# EAGLE design hub (EAGLE 6.4)
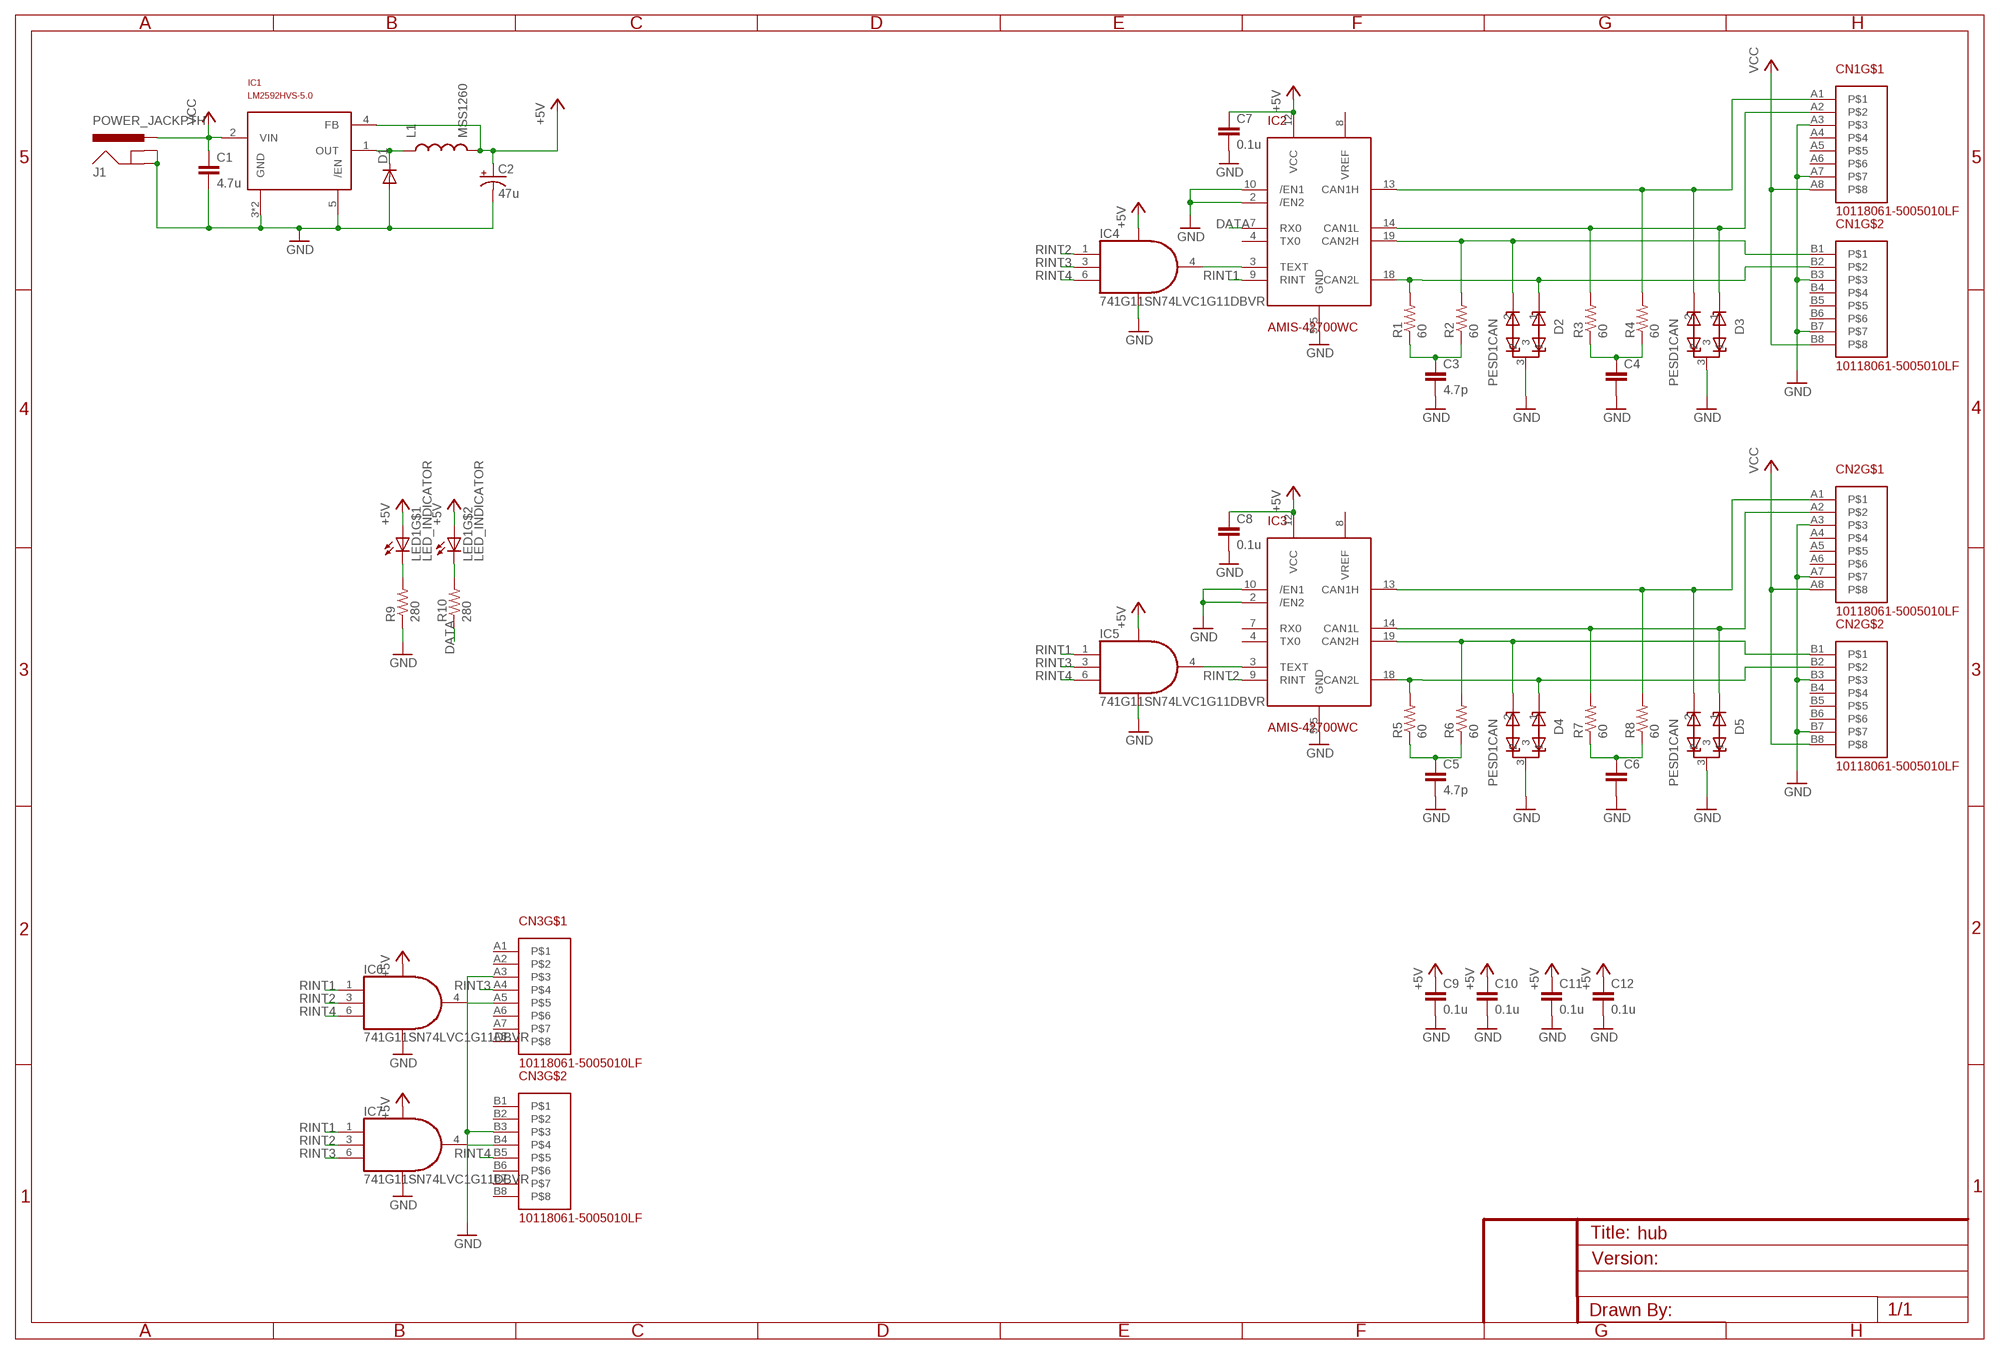
[diagram p0: schematic, sheet 1]

## Parts
C1  4.7u  CAP1206  [1206]
C2  47u  CAP_POLC  [PANASONIC_C]
C3  4.7p  CAP0603-CAP  [0603-CAP]
C4  CAP0603-CAP  [0603-CAP]
C5  4.7p  CAP0603-CAP  [0603-CAP]
C6  CAP0603-CAP  [0603-CAP]
C7  0.1u  CAP0603-CAP  [0603-CAP]
C8  0.1u  CAP0603-CAP  [0603-CAP]
C9  0.1u  CAP0603-CAP  [0603-CAP]
C10  0.1u  CAP0603-CAP  [0603-CAP]
C11  0.1u  CAP0603-CAP  [0603-CAP]
C12  0.1u  CAP0603-CAP  [0603-CAP]
CN1  10118061-5005010LF  [10118061]
CN2  10118061-5005010LF  [10118061]
CN3  10118061-5005010LF  [10118061]
D1  DIODESMA-ALT  [SMA-DIODE_ALT]
D2  PESD1CAN  [SOT23]
D3  PESD1CAN  [SOT23]
D4  PESD1CAN  [SOT23]
D5  PESD1CAN  [SOT23]
IC1  LM2592HVS-5.0  LM2595NDH  [TO263-5]
IC2  AMIS-42700WC  [SO20W]
IC3  AMIS-42700WC  [SO20W]
IC4  741G11SN74LVC1G11DBVR  [SOT23-6]
IC5  741G11SN74LVC1G11DBVR  [SOT23-6]
IC6  741G11SN74LVC1G11DBVR  [SOT23-6]
IC7  741G11SN74LVC1G11DBVR  [SOT23-6]
J1  POWER_JACKPTH  [POWER_JACK_PTH]
L1  MSS1260  [MSS1260]
LED1  LED_INDICATOR  [LED_INDICATOR]
R1  60  RESISTOR0603-RES  [0603-RES]
R2  60  RESISTOR0603-RES  [0603-RES]
R3  60  RESISTOR0603-RES  [0603-RES]
R4  60  RESISTOR0603-RES  [0603-RES]
R5  60  RESISTOR0603-RES  [0603-RES]
R6  60  RESISTOR0603-RES  [0603-RES]
R7  60  RESISTOR0603-RES  [0603-RES]
R8  60  RESISTOR0603-RES  [0603-RES]
R9  280  RESISTOR0603-RES  [0603-RES]
R10  280  RESISTOR0603-RES  [0603-RES]

## Nets
+5V: C2.+ C7.1 C8.1 C9.1 C10.1 C11.1 C12.1 IC1.4(FB) IC2.12(VCC) IC3.12(VCC) IC4.5(VCC) IC5.5(VCC) IC6.5(VCC) IC7.5(VCC) L1.P$2 LED1.A1(A) LED1.A2(A)
CAN1H: CN1.A1 D3.2 IC2.13(CAN1H) R4.2
CAN1L: CN1.A2 D3.1 IC2.14(CAN1L) R3.2
CAN2H: CN1.B1 D2.2 IC2.19(CAN2H) R2.2
CAN2L: CN1.B2 D2.1 IC2.18(CAN2L) R1.2
CAN3H: CN2.A1 D5.2 IC3.13(CAN1H) R8.2
CAN3L: CN2.A2 D5.1 IC3.14(CAN1L) R7.2
CAN4H: CN2.B1 D4.2 IC3.19(CAN2H) R6.2
CAN4L: CN2.B2 D4.1 IC3.18(CAN2L) R5.2
DATA: IC2.7(RX0) R10.1
GND: C1.2 C2.- C3.2 C4.2 C5.2 C6.2 C7.2 C8.2 C9.2 C10.2 C11.2 C12.2 CN1.A3 CN1.A7 CN1.B3 CN1.B7 CN2.A3 CN2.A7 CN2.B3 CN2.B7 CN3.A3 CN3.B3 D1.A D2.3 D3.3 D4.3 D5.3 IC1.3(GND) IC1.5(/EN) IC1.6(GND) IC2.2(/EN2) IC2.5(GND) IC2.6(GND) IC2.10(/EN1) IC2.15(GND) IC2.16(GND) IC2.17(GND) IC3.2(/EN2) IC3.5(GND) IC3.6(GND) IC3.10(/EN1) IC3.15(GND) IC3.16(GND) IC3.17(GND) IC4.2(GND) IC5.2(GND) IC6.2(GND) IC7.2(GND) J1.GND J1.GNDBREAK R9.1
N$1: IC2.3(TEXT) IC4.4(O)
N$2: C3.1 R1.1 R2.1
N$3: C4.1 R3.1 R4.1
N$4: IC3.3(TEXT) IC5.4(O)
N$5: C5.1 R5.1 R6.1
N$7: C6.1 R7.1 R8.1
N$8: CN3.A5 IC6.4(O)
N$9: CN3.B4 IC7.4(O)
N$10: LED1.C1(C) R9.2
N$11: LED1.C2(C) R10.2
RINT1: IC2.9(RINT) IC5.1(I0) IC6.1(I0) IC7.1(I0)
RINT2: IC3.9(RINT) IC4.1(I0) IC6.3(I1) IC7.3(I1)
RINT3: CN3.A4 IC4.3(I1) IC5.3(I1) IC7.6(I2)
RINT4: CN3.B5 IC4.6(I2) IC5.6(I2) IC6.6(I2)
SWOUT: D1.C IC1.1(OUT) L1.P$1
VCC: C1.1 CN1.A8 CN1.B8 CN2.A8 CN2.B8 IC1.2(VIN) J1.PWR
Unconnected: CN1.A4 CN1.A5 CN1.A6 CN1.B4 CN1.B5 CN1.B6 CN2.A4 CN2.A5 CN2.A6 CN2.B4 CN2.B5 CN2.B6 CN3.A1 CN3.A2 CN3.A6 CN3.A7 CN3.A8 CN3.B1 CN3.B2 CN3.B6 CN3.B7 CN3.B8 IC2.4(TX0) IC2.8(VREF) IC3.4(TX0) IC3.7(RX0) IC3.8(VREF)

## Library data of the parts
C1 C7-C12 = SparkFun-Capacitors:CAP: Capacitor Standard 0603 ceramic capacitor, and 0.1" leaded capacitor.
C2 = SparkFun-Capacitors:CAP_POL: Capacitor Polarized These are standard SMD and PTH capacitors. Normally 10uF, 47uF, and 100uF in electrolytic and tantalum varieties. Always verify the external diameter of the through hole cap, it varies with capacity, voltage, and manufacturer. The EIA devices should be standard.
C3-C6 = SparkFun-Passives:CAP: Capacitor Standard 0603 ceramic capacitor, and 0.1" leaded capacitor.
CN1-CN3 = nickparts:10118061
D1 = SparkFun-DiscreteSemi:DIODE: Diode These are standard reverse protection diodes and small signal diodes. SMA package can handle up to about 1A. SOD-323 can handle about 200mA. What the SOD-323 package when ordering, there are some mfgs out there that are 5-pin packages.
D2-D5 = nickparts:PESD1CAN
IC1 = nickparts:LM2595
IC2 IC3 = nickparts:AMIS-42700
IC4-IC7 = nickparts:74*1G11
J1 = SparkFun-Connectors:POWER_JACK: Power Jack This is the standard 5.5mm barrel jack for power. The PTH is the most common, proven, reliable, footprint. The Slot footprint only works if the mill layer is transmitted to the PCB fab house so be warned. Spark Fun Electronics SKU : PRT-00119 SMT: CONN-08106 Mating wall wart : TOL-00298 (and others)
L1 = nickparts:MSS1260
LED1 = nickparts:LED_INDICATOR
R1-R10 = SparkFun-Passives:RESISTOR: Resistor Basic schematic elements and footprints for 0603, 1206, and PTH resistors.

## Board
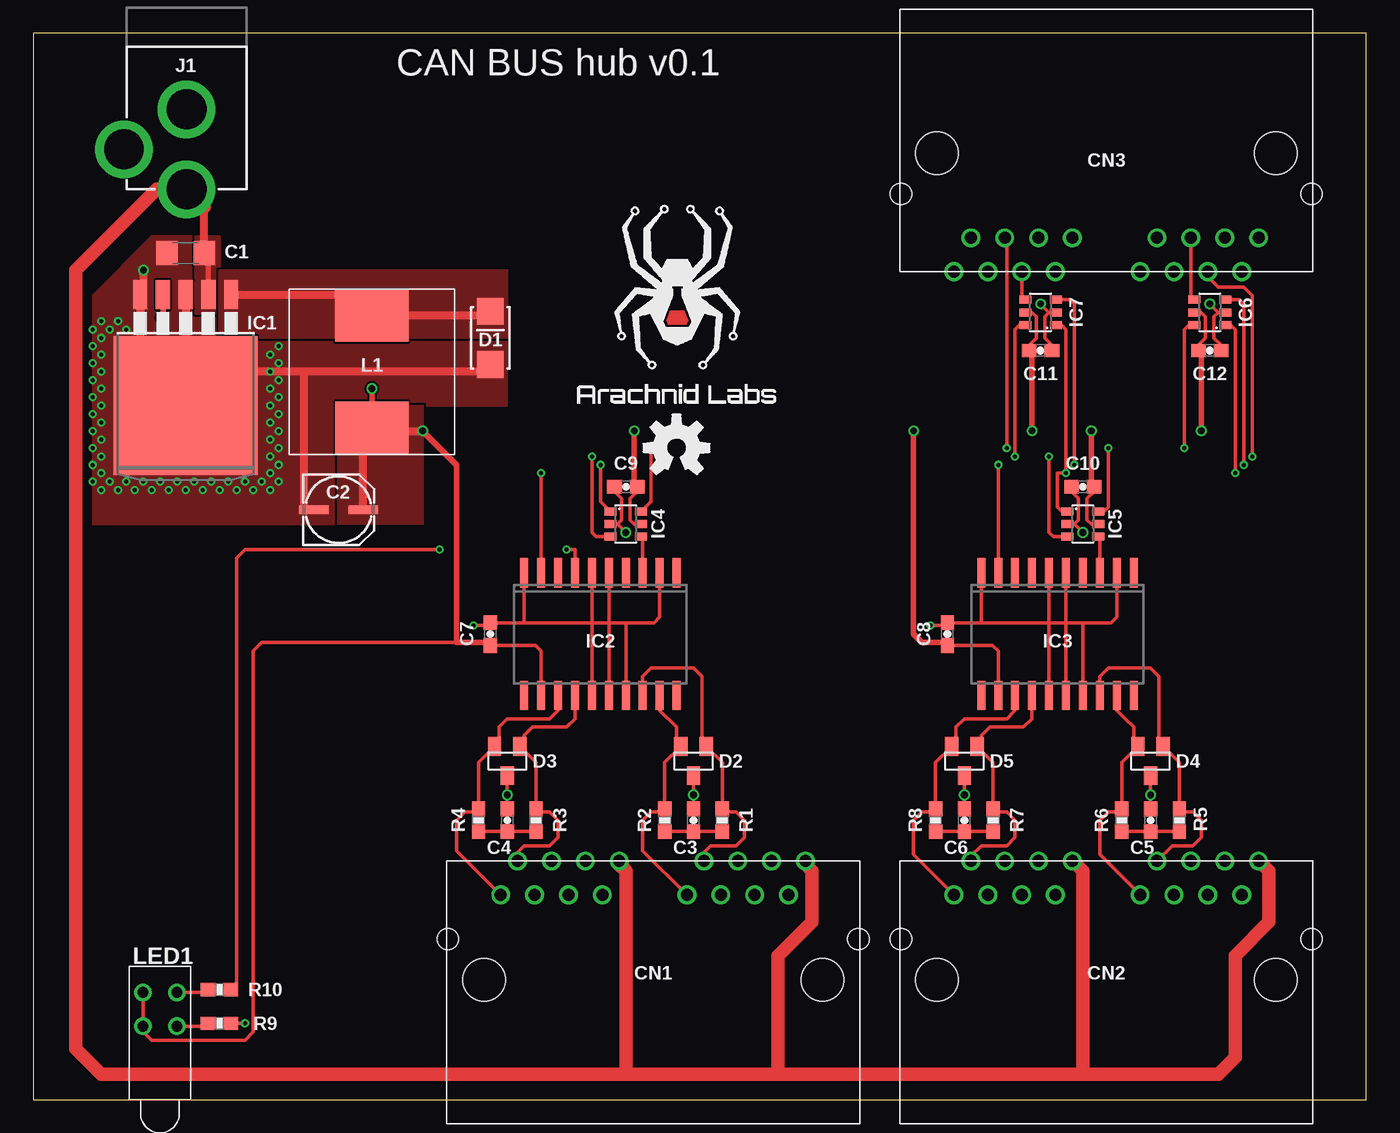
[diagram p1: board, top side]
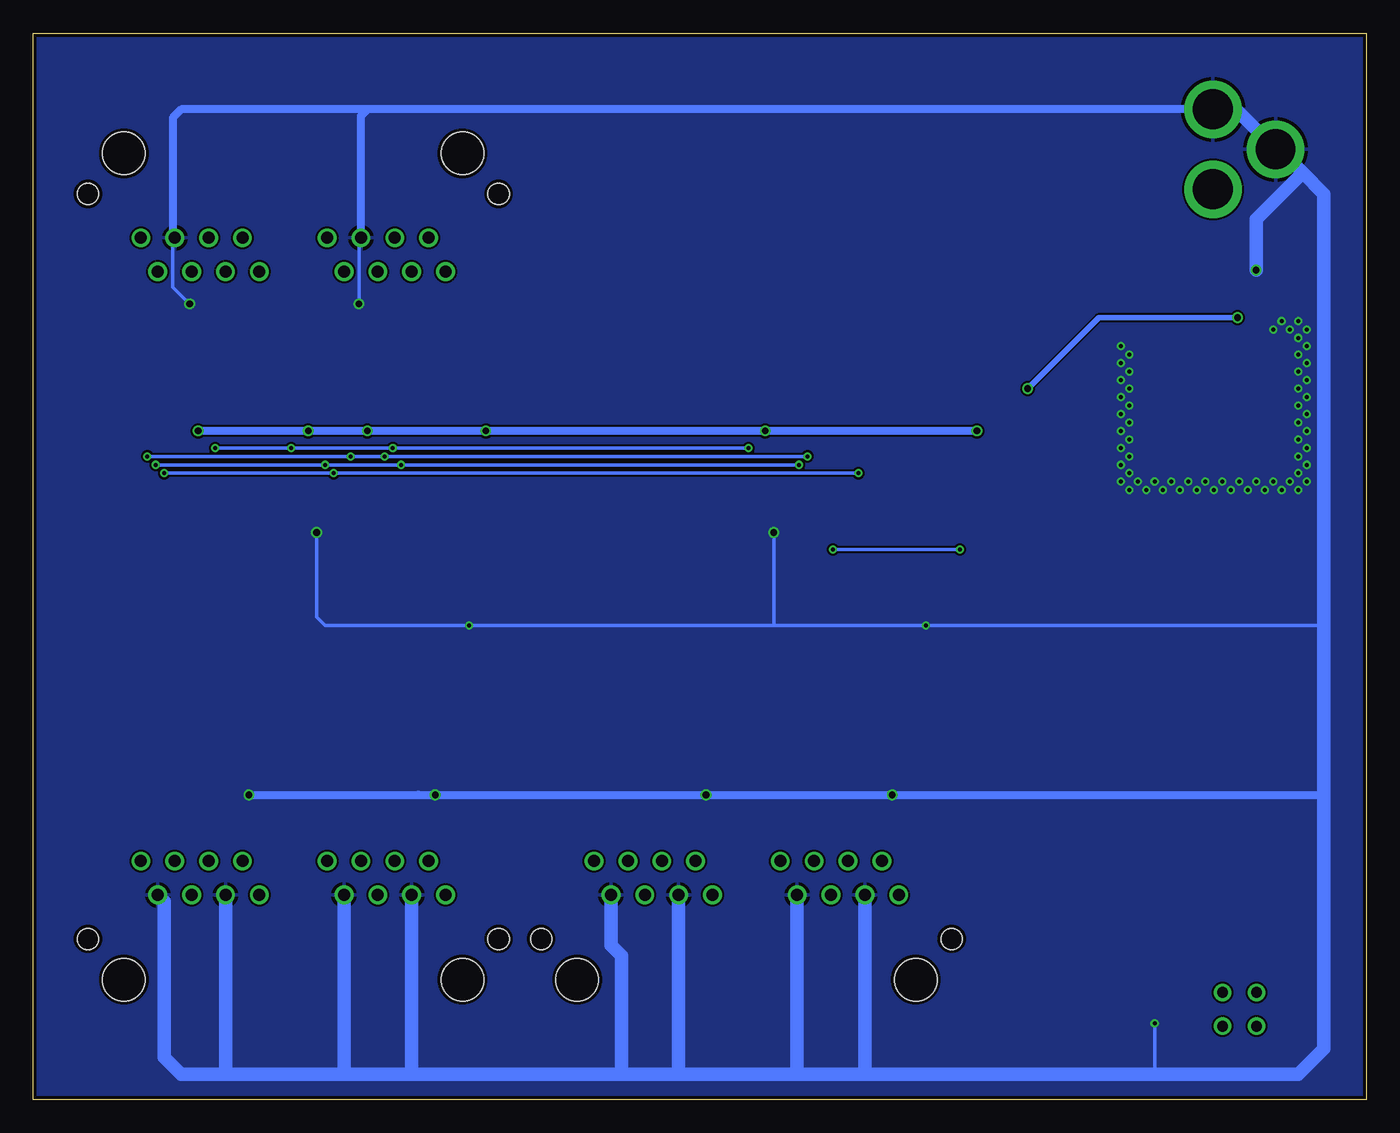
[diagram p2: board, bottom side, seen from below]

Size 100 x 80 mm. Coordinates in mm from the lower left corner, seen from the top.
Outline: 0,0 100,0 100,80 0,80 0,0
Copper layers (1*16): Top 0.035mm / dielectric 1.5mm / Bottom 0.035mm
Design rules "Fusion_eagle_rule_v1.1 *": minimum track width 6mil, minimum drill 0.3mm, track to track 6mil, track to pad 6mil, pad to pad 6mil, via to via 6mil, smd to smd 0mil, copper to edge 10mil, drill to drill 10mil, minimum pad ring 10mil, minimum via ring 6mil, stop-mask expansion 2mil, vias tented up to drill 100mil, thermal gap 10mil
tKeepout: area 0,0 to 2,80; area 98,0 to 100,80

### Footprints (pad centres in the part's own frame; a part is rotated, then mirrored left to right if it is on the bottom)
1206 = smd 1.6 x 1.8: 1 -1.4,0; 2 1.4,0
PANASONIC_C = smd 2.2 x 0.65: + 1.9,-0.2; - -1.8,-0.2
0603-CAP = smd 1.1 x 1: 1 -0.85,0; 2 0.85,0
10118061 = drill 0.9: A1 -11.43,6.35; A2 -10.16,8.89; A3 -8.89,6.35; A4 -7.62,8.89; A5 -6.35,6.35; A6 -5.08,8.89; A7 -3.81,6.35; A8 -2.54,8.89; B1 2.54,6.35; B2 3.81,8.89; B3 5.08,6.35; B4 6.35,8.89; B5 7.62,6.35; B6 8.89,8.89; B7 10.16,6.35; B8 11.43,8.89 | hole 3.2: -12.7,0; 12.7,0 | hole 1.6: -15.4,3.05; 15.4,3.05
SMA-DIODE_ALT = smd 2 x 2: A -2,0; C 2,0
SOT23 = smd 1 x 1.4: 1 -0.95,-1.1; 2 0.95,-1.1; 3 0,1.1
TO263-5 = smd 1.067 x 2.159: 1 -3.404,-5.791; 2 -1.702,-5.791; 3 0,-5.791; 4 1.702,-5.791; 5 3.404,-5.791 | smd 10.8 x 10.41: 6 0,2.54
SO20W = smd 0.6 x 2.2: 1 -5.715,-4.6; 2 -4.445,-4.6; 3 -3.175,-4.6; 4 -1.905,-4.6; 5 -0.635,-4.6; 6 0.635,-4.6; 7 1.905,-4.6; 8 3.175,-4.6; 9 4.445,-4.6; 10 5.715,-4.6; 11 5.715,4.6; 12 4.445,4.6; 13 3.175,4.6; 14 1.905,4.6; 15 0.635,4.6; 16 -0.635,4.6; 17 -1.905,4.6; 18 -3.175,4.6; 19 -4.445,4.6; 20 -5.715,4.6
SOT23-6 = smd 0.6 x 0.9: 1 -0.95,-1.15; 2 0,-1.15; 3 0.95,-1.15; 4 0.95,1.15; 5 0,1.15; 6 -0.95,1.15
POWER_JACK_PTH = drill 2.997 pad 4.318: GND 0,7.7; GNDBREAK 4.7,10.7; PWR 0,13.7
MSS1260 = smd 5.5 x 4: P$1 0,4.25; P$2 0,-4.25
LED_INDICATOR = drill 0.8: A1 1.27,0; A2 1.27,-2.54; C1 -1.27,0; C2 -1.27,-2.54
0603-RES = smd 1.1 x 1: 1 -0.85,0; 2 0.85,0

### Placement (x,y rotation side)
C1  11.43,63.5 180 top
C2  22.86,44.45 0 top
C3  49.53,20.95 90 top
C4  35.56,20.95 90 top
C5  83.82,20.95 90 top
C6  69.85,20.95 90 top
C7  34.29,34.92 90 top
C8  68.58,34.92 90 top
C9  44.45,45.97 180 top
C10  78.74,45.97 180 top
C11  75.56,56.2 0 top
C12  88.27,56.2 0 top
CN1  46.5,9 0 top
CN2  80.5,9 0 top
CN3  80.5,71 180 top
D1  34.29,57.15 90 top
D2  49.53,25.4 180 top
D3  35.56,25.4 180 top
D4  83.82,25.4 180 top
D5  69.85,25.4 180 top
IC1  11.43,54.61 180 top
IC2  42.55,34.92 180 top
IC3  76.83,34.92 180 top
IC4  44.45,43.18 270 top
IC5  78.74,43.18 270 top
IC6  88.27,59.05 90 top
IC7  75.56,59.05 90 top
J1  11.5,82 180 top
L1  25.4,54.61 0 top
LED1  9.5,5.5 180 top
R1  51.69,20.95 90 top
R2  47.37,20.95 90 top
R3  37.72,20.95 90 top
R4  33.4,20.95 90 top
R5  85.98,20.95 90 top
R6  81.66,20.95 90 top
R7  72.01,20.95 90 top
R8  67.69,20.95 90 top
R9  13.97,5.71 180 top
R10  13.97,8.26 180 top
U$1  [ARACHNID_LABS_LOGO]  48.26,62.23 0 top
U$2  [OSHW-LOGO-M]  48.26,48.9 0 top

### Tracks (layer width: path | path; a pad name or v marks a point on that pad's centre or on a via)
+5V  (via drill 0.5)
  Top 0.254: C9.1 45.3,45.62 44.77,45.09 44.77,43.5 45.09,43.18 IC4.5 | C10.1 79.59,45.62 79.06,45.09 79.06,43.5 79.38,43.18 IC5.5 | IC3.12 72.39,33.66 71.97,34.08 C8.1 | C7.1 37.68,34.08 38.1,33.66 IC2.12 | LED1.A1 LED1.A2 8.23,5.74 8.26,5.71 8.26,5.08 8.89,4.45 15.88,4.45 16.51,5.08 16.51,33.66 17.14,34.29 31.75,34.29 | C11.1 74.72,56.62 75.25,57.15 75.25,58.74 74.93,59.05 IC7.5 | C12.1 87.42,56.62 87.95,57.15 87.95,58.74 87.63,59.05 IC6.5
  Top 0.406: IC1.4 9.73,58.75 v9.65,58.67 | v25.4,53.34 L1.P$2 | v87.63,50.16 87.63,55.98 C12.1 | C11.1 74.72,56.09 74.93,55.88 v74.93,50.16 | C10.1 79.59,46.14 79.38,46.35 v79.38,50.16 | 45.3,45.62 45.3,46.14 45.09,46.35 v45.09,50.16 | C8.1 68.58,34.29 66.67,34.29 66.04,34.92 v66.04,50.16 | C7.1 34.29,34.29 31.75,34.29 31.75,34.92 31.75,47.62 v29.21,50.16
  Top 0.61: L1.P$2 24.76,49.72 C2.+ 24.76,50.16 24.77,50.16 v29.21,50.16
  Bottom 0.406: v9.65,58.67 20.07,58.67 v25.4,53.34 | v74.93,50.16 74.3,50.16 | v79.38,50.16 78.74,50.16 | v45.09,50.16 44.45,50.16 | v66.04,50.16 64.77,50.16
  Bottom 0.61: v29.21,50.16 44.45,50.16 v45.09,50.16 64.77,50.16 v66.04,50.16 74.3,50.16 v74.93,50.16 78.74,50.16 v79.38,50.16 v87.63,50.16
  pour Top (no thermals): 29.21,43.18 22.86,43.18 22.86,52.07 29.21,52.07
CAN1H
  Top 0.254: CN1.A1 31.75,18.67 31.75,20.95 32.38,21.59 33.02,21.59 33.23,21.8 R4.2 33.4,25.29 D3.2 34.92,26.82 34.92,27.94 35.56,28.57 38.73,28.57 39.37,29.21 IC2.13
CAN1L
  Top 0.254: CN1.A2 36.34,18.56 36.83,19.05 38.73,19.05 39.37,19.68 39.37,20.95 38.73,21.59 37.93,21.59 R3.2 37.72,25.29 36.9,26.11 | 36.9,26.11 D3.1 | IC2.14 40.64,28.57 40.01,27.94 37.47,27.94 36.83,27.3 36.83,26.18 36.9,26.11
CAN2H
  Top 0.254: CN1.B1 45.72,18.67 45.72,20.95 46.35,21.59 46.99,21.59 47.2,21.8 R2.2 47.37,25.29 D2.2 48.26,26.82 48.26,27.94 46.99,29.21 IC2.19
CAN2L
  Top 0.254: CN1.B2 50.31,18.56 50.8,19.05 52.7,19.05 53.34,19.68 53.34,20.95 52.7,21.59 51.9,21.59 R1.2 51.69,25.29 D2.1 50.34,26.5 50.16,26.67 50.16,31.75 49.53,32.38 46.35,32.38 45.72,31.75 IC2.18
CAN3H
  Top 0.254: CN2.A1 66.04,18.38 66.04,20.95 66.67,21.59 67.31,21.59 67.53,21.8 R8.2 67.69,25.29 D5.2 69.22,26.82 69.22,27.94 69.85,28.57 73.03,28.57 73.66,29.21 IC3.13
CAN3L
  Top 0.254: CN2.A2 70.34,18.27 71.12,19.05 73.03,19.05 73.66,19.68 73.66,20.95 73.03,21.59 72.22,21.59 R7.2 72.01,25.29 D5.1 71.12,26.82 71.12,27.3 71.75,27.94 74.3,27.94 74.93,28.57 IC3.14
CAN4H
  Top 0.254: CN2.B1 80.01,18.38 80.01,20.95 80.64,21.59 81.92,21.59 81.7,21.8 R6.2 81.66,25.29 D4.2 82.55,26.82 82.55,27.94 81.92,28.57 81.28,29.21 IC3.19
CAN4L
  Top 0.254: CN2.B2 85.47,19.05 87,19.05 87.63,19.68 87.63,20.95 87,21.59 86.36,21.59 86.14,21.8 R5.2 85.98,25.29 D4.1 84.62,26.5 84.45,26.67 84.45,31.75 83.82,32.38 80.64,32.38 80.01,31.75 IC3.18
DATA  (via drill 0.3)
  Top 0.254: R10.1 15.24,8.26 15.24,40.64 15.88,41.27 v30.48,41.27 | v40.01,41.27 40.64,41.27 IC2.7
  Bottom 0.254: v30.48,41.27 v40.01,41.27
GND  (via drill 0.3, 0.5)
  Top 0.254: D5.3 C6.2 69.85,22.23 v69.85,22.86 | v83.82,22.86 C5.2 v83.82,22.86 | v83.82,22.86 D4.3 | D2.3 C3.2 49.53,22.23 v49.53,22.86 | C4.2 v35.56,22.86 | v35.56,22.86 D3.3 | C9.2 43.6,45.62 44.13,45.09 44.13,43.5 43.81,43.18 | 43.81,43.18 IC4.2 43.81,43.18 | C10.2 77.89,45.62 78.42,45.09 78.42,43.5 78.11,43.18 | 78.11,43.18 IC5.2 78.11,43.18 | R9.1 v15.88,5.71 | 71.12,35.77 76.2,35.77 | 76.2,35.77 77.47,35.77 | 77.47,35.77 78.74,35.77 | 78.74,35.77 80.86,35.77 81.28,36.2 IC3.2 | IC3.5 77.47,35.77 | IC3.6 76.2,35.77 | IC3.10 71.12,35.77 | IC3.15 76.2,35.77 | IC3.16 77.47,35.77 | IC3.17 78.74,35.77 | 36.83,35.77 41.91,35.77 | 41.91,35.77 43.18,35.77 | 43.18,35.77 44.45,35.77 | 44.45,35.77 46.57,35.77 46.99,36.2 IC2.2 | IC2.17 44.45,35.77 | IC2.16 43.18,35.77 | IC2.15 41.91,35.77 | IC2.5 43.18,35.77 | IC2.6 41.91,35.77 | IC2.10 36.83,35.77 | v33.02,35.56 34.29,35.56 C7.2 36.83,35.77 | v67.31,35.56 68.58,35.56 C8.2 71.12,35.77 | 76.2,59.05 75.88,58.74 75.88,57.15 76.42,56.62 C11.2 76.42,56.09 76.2,55.88 | 76.2,59.05 IC7.2 | C12.2 89.11,56.62 88.58,57.15 88.58,58.74 88.9,59.05 | 88.9,59.05 IC6.2 88.9,59.05 | C4.2 v35.56,22.86 | 43.81,43.18 v44.45,42.55 | 78.11,43.18 v78.74,42.55 | 76.2,59.05 v75.56,59.69 | 88.9,59.05 v88.27,59.69 | C4.2 35.56,22.23 v35.56,22.86
  Top 0.61: IC1.3 11.43,59.69 11.43,54.61 | 11.43,54.61 IC1.6 8.03,55.47 8.03,59.69 IC1.5 8.26,60.63 v8.26,62.23 | D1.A 34.29,54.61 20.32,54.61 | 20.32,54.61 v17.78,54.61 11.43,54.61 | C2.- 20.52,44.25 20.32,44.45 20.32,54.61
  Bottom 0.254: v15.88,5.71 15.88,1.91 | 3.17,35.56 v33.02,35.56 44.45,35.56 | 44.45,35.56 v67.31,35.56 78.11,35.56 78.74,36.2 v78.74,42.55 | v44.45,42.55 44.45,35.56 | v75.56,59.69 75.56,64.5 CN3.B3 | v88.27,59.69 89.53,60.96 89.53,64.5 CN3.A3 | v69.85,22.86 71.12,22.86
  Bottom 0.61: 74.93,74.3 J1.GND 9.8,74.3 | 74.93,74.3 88.89,74.3 89.53,73.66 89.53,64.8 CN3.A3 | CN3.B3 75.42,73.81 74.93,74.3 | v83.82,22.86 71.12,22.86 v69.85,22.86 v49.53,22.86 v35.56,22.86 3.17,22.86
  Bottom 1.016: 9.8,74.3 J1.GNDBREAK 6.53,71.3 4.76,69.53 | 4.76,69.53 3.17,67.94 3.17,35.56 3.17,22.86 3.17,3.81 5.08,1.91 15.88,1.91 37.47,1.91 | 37.47,1.91 42.55,1.91 | 42.55,1.91 51.44,1.91 | 51.44,1.91 55.88,1.91 | 55.88,1.91 71.75,1.91 | 71.75,1.91 76.83,1.91 | 76.83,1.91 85.72,1.91 | 85.72,1.91 88.9,1.91 90.17,3.17 90.17,14.86 CN2.B7 | CN2.B3 85.58,2.05 85.72,1.91 | CN2.A7 76.69,2.05 76.83,1.91 | CN2.A3 71.61,2.05 71.75,1.91 | CN1.B7 56.66,11.57 55.88,10.79 55.88,1.91 | CN1.B3 51.58,2.05 51.44,1.91 | CN1.A7 42.69,2.05 42.55,1.91 | CN1.A3 37.61,2.05 37.47,1.91 | v8.26,62.23 8.26,66.04 4.76,69.53
  other vias: 6.99,57.78 6.35,58.42 5.71,57.78 5.08,58.42 4.45,57.78 5.08,57.15 4.45,56.52 5.08,55.88 4.45,55.24 5.08,54.61 4.45,53.98 5.08,53.34 4.45,52.7 5.08,52.07 4.45,51.44 5.08,50.8 4.45,50.16 5.08,49.53 4.45,48.9 5.08,48.26 4.45,47.62 5.08,46.99 4.45,46.35 5.08,45.72 5.71,46.35 6.35,45.72 6.99,46.35 7.62,45.72 8.26,46.35 8.89,45.72 9.53,46.35 10.16,45.72 10.79,46.35 11.43,45.72 12.06,46.35 12.7,45.72 13.34,46.35 13.97,45.72 14.61,46.35 15.24,45.72 15.88,46.35 16.51,45.72 17.78,45.72 17.14,46.35 17.78,46.99 18.41,47.62 17.78,48.26 18.41,48.9 17.78,49.53 18.41,50.16 17.78,50.8 18.41,51.44 17.78,52.07 18.41,52.7 17.78,53.34 17.78,55.88 18.41,56.52 18.41,55.24 18.41,53.98 18.41,46.35
  pour Top (rank 3, no thermals): 13.97,64.77 8.89,64.77 4.45,60.33 4.45,43.18 22.86,43.18 22.86,52.07 35.56,52.07 35.56,57.15 13.97,57.15
  pour Bottom: 0,0 100.33,0 100.33,80.01 0,80.01
N$1
  Top 0.254: IC2.3 45.72,42.11 IC4.4
N$2
  Top 0.254: R2.1 C3.1 R1.1
N$3
  Top 0.254: R3.1 C4.1 R4.1
N$4
  Top 0.254: IC3.3 80.01,42.11 IC5.4
N$5
  Top 0.254: R6.1 C5.1 R5.1
N$7
  Top 0.254: R8.1 C6.1 R7.1
N$8
  Top 0.254: CN3.A5 86.85,60.27 IC6.4
N$9
  Top 0.254: CN3.B4 74.15,60.27 IC7.4
N$10
  Top 0.254: LED1.C1 12.9,5.5 R9.2
N$11
  Top 0.254: LED1.C2 12.9,8.04 R10.2
RINT1  (via drill 0.3)
  Top 0.254: IC2.9 38.1,46.35 v38.1,46.99 | IC7.1 77.15,58.1 77.47,57.78 v77.47,46.99 76.83,46.99 76.83,44.45 77.16,44.13 IC5.1 | IC6.1 89.85,58.1 90.17,57.78 90.17,47.62 v90.17,46.99
  Bottom 0.254: v38.1,46.99 76.83,46.99 | 76.83,46.99 v77.47,46.99 | v77.47,46.99 v90.17,46.99 | v77.47,46.99 76.83,46.99
RINT2  (via drill 0.3)
  Top 0.254: IC3.9 v72.39,47.62 | v42.55,47.62 42.55,44.88 IC4.1 | v90.81,47.62 90.81,59.69 90.49,60.01 IC6.3 | IC7.3 77.79,60.01 78.11,59.69 v78.11,47.62
  Bottom 0.254: v42.55,47.62 v72.39,47.62 v78.11,47.62 | v78.11,47.62 78.74,47.62 | 78.74,47.62 v90.81,47.62 | v78.11,47.62 78.74,47.62
RINT3  (via drill 0.3)
  Top 0.254: CN3.A4 88.12,61.74 88.9,60.96 90.81,60.96 91.44,60.33 v91.44,48.26 | v41.91,48.26 41.91,42.55 42.23,42.23 IC4.3 | IC5.3 76.52,42.23 76.2,42.55 v76.2,48.26 | IC7.6 73.98,58.1 73.66,57.78 v73.66,48.26
  Bottom 0.254: v91.44,48.26 v76.2,48.26 | v76.2,48.26 75.56,48.26 | 75.56,48.26 74.3,48.26 | 74.3,48.26 v73.66,48.26 | v73.66,48.26 v41.91,48.26 | v76.2,48.26 75.56,48.26 | v73.66,48.26 74.3,48.26
RINT4  (via drill 0.3)
  Top 0.254: CN3.B5 72.88,64.28 73.03,64.14 v73.03,48.9 | v86.36,48.9 86.36,57.78 86.68,58.1 IC6.6 | IC5.6 80.33,44.13 80.64,44.45 v80.64,48.9 | v46.35,48.9 46.35,44.88 IC4.6
  Bottom 0.254: 80.01,48.9 v73.03,48.9 v46.35,48.9 | 80.01,48.9 v80.64,48.9 | v80.64,48.9 v86.36,48.9 | v80.64,48.9 80.01,48.9
SWOUT
  Top 0.61: IC1.1 23.86,60.4 L1.P$1 34,58.86 D1.C
  pour Top (no thermals): 35.56,57.15 13.97,57.15 13.97,62.23 35.56,62.23
VCC
  Top 0.406: IC1.2 13.13,63.2 C1.1
  Top 0.61: C1.1 12.83,66.97
  Top 1.016: 44.45,1.91 5.08,1.91 3.17,3.81 3.17,62.23 9.24,68.3 J1.PWR 12.83,66.97 | 44.45,1.91 55.88,1.91 | 55.88,1.91 78.74,1.91 | 78.74,1.91 88.9,1.91 90.17,3.17 90.17,10.79 92.71,13.34 92.71,17.14 91.97,17.89 CN2.B8 | CN2.A8 78,17.89 78.74,17.14 78.74,1.91 | CN1.B8 57.93,17.64 58.42,17.14 58.42,13.34 56.52,11.43 55.88,10.79 55.88,1.91 | CN1.A8 43.96,17.64 44.45,17.14 44.45,1.91
  pour Top (rank 2, no thermals): 12.19,58.93 12.19,64.77 13.97,64.77 13.97,58.93

### Text on the board
tNames: CAN BUS hub v0.1